# EAGLE schematic airwisk_mosfet (EAGLE 7.7.0)
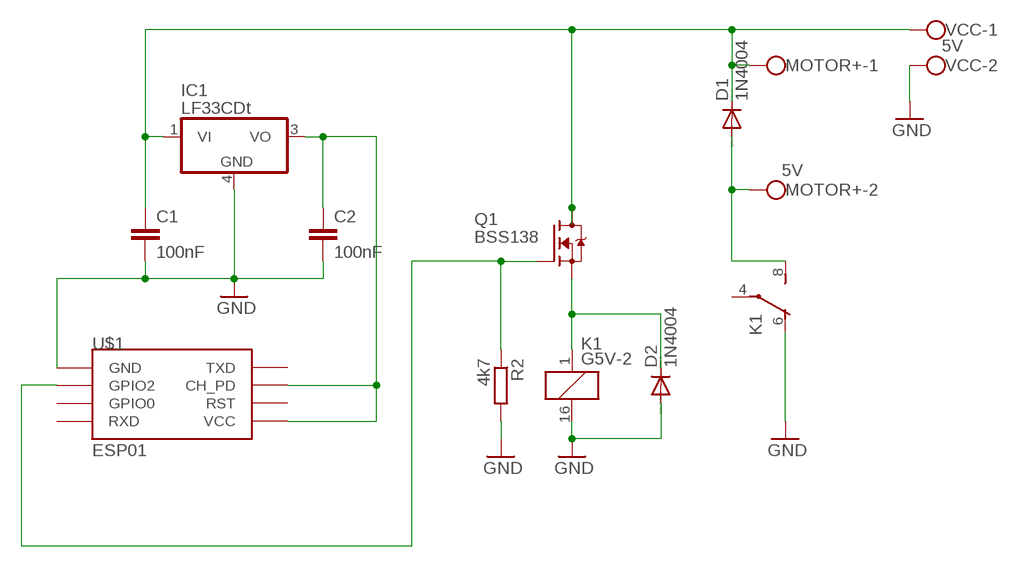
[diagram p0: schematic, sheet 1]

## Parts
C1  100nF  C-EU025-025X050  [C025-025X050]
C2  100nF  C-EU025-025X050  [C025-025X050]
D1  1N4004  [DO41-10]
D2  1N4004  [DO41-10]
IC1  LF33CDt  MC78M05ABDT  [DPACK_3]
K1  G5V-2  [G5V-2]
MOTOR+  5V  W237-102  [W237-102]
Q1  BSS138  [SOT23]
R2  4k7  R-EU_0204/7  [0204/7]
U$1  ESP01  [ESP01]
VCC  5V  W237-102  [W237-102]

## Nets
GND: C1.2 C2.2 D2.A IC1.4(GND) K1.6(1:O) K1.16 R2.2 U$1.GND VCC.2
N$1 [ground]: C1.1 D1.C IC1.1(VI) MOTOR+.1 Q1.3(D) VCC.1
N$2: D1.A K1.8(1:S) MOTOR+.2
N$3: Q1.1(G) R2.1 U$1.GPIO2
N$4: D2.C K1.1 Q1.2(S)
N$5: C2.1 IC1.3(VO) U$1.CH_PD U$1.VCC
Unconnected: K1.4(1:P) K1.9(2:S) K1.11(2:O) K1.13(2:P) U$1.GPIO0 U$1.RST U$1.RX(RXD) U$1.TX(TXD)

## Library data of the parts
C1 C2 = rcl:C-EU: CAPACITOR, European symbol
D1 D2 = diode:1N4004: DIODE general purpose rectifier, 1 A
IC1 = linear:MC78M: 500 mA Positive Voltage Regulators Source: Data sheet <http://www.onsemi.com/pub_link/Collateral/MC78M00-D.PDF>
K1 = relay:G5V-2: OMRON PCB Relay Source: http://www.omron.com/ecb/products/pdf/en-g5v2.pdf; MPN: G5V-2 5DC; OC_FARNELL: 9949488; OC_NEWARK: 78K5703
MOTOR+ VCC = con-wago-500:W237-102: WAGO SCREW CLAMP; MPN: 237-102; OC_FARNELL: unknown; OC_NEWARK: 70K9898
Q1 = bss138_10:BSS138: BSS138 N-Channel Logic Level Enhancement Mode Field Effect Transistor Source: http://www.fairchildsemi.com/datasheets/BS/BSS138.pdf; MF: Fairchild; MPN: BSS138; OC_FARNELL: 9845330; OC_NEWARK: 67R2009
R2 = resistor:R-EU_: RESISTOR, European symbol
U$1 = esp8266modules:ESP01: ESP8266 Wifi module 01

## Net classes
0 default: width 0.406 mm
1 ground: width 0.61 mm